# EAGLE design with_usb_small (EAGLE 8.3.1)
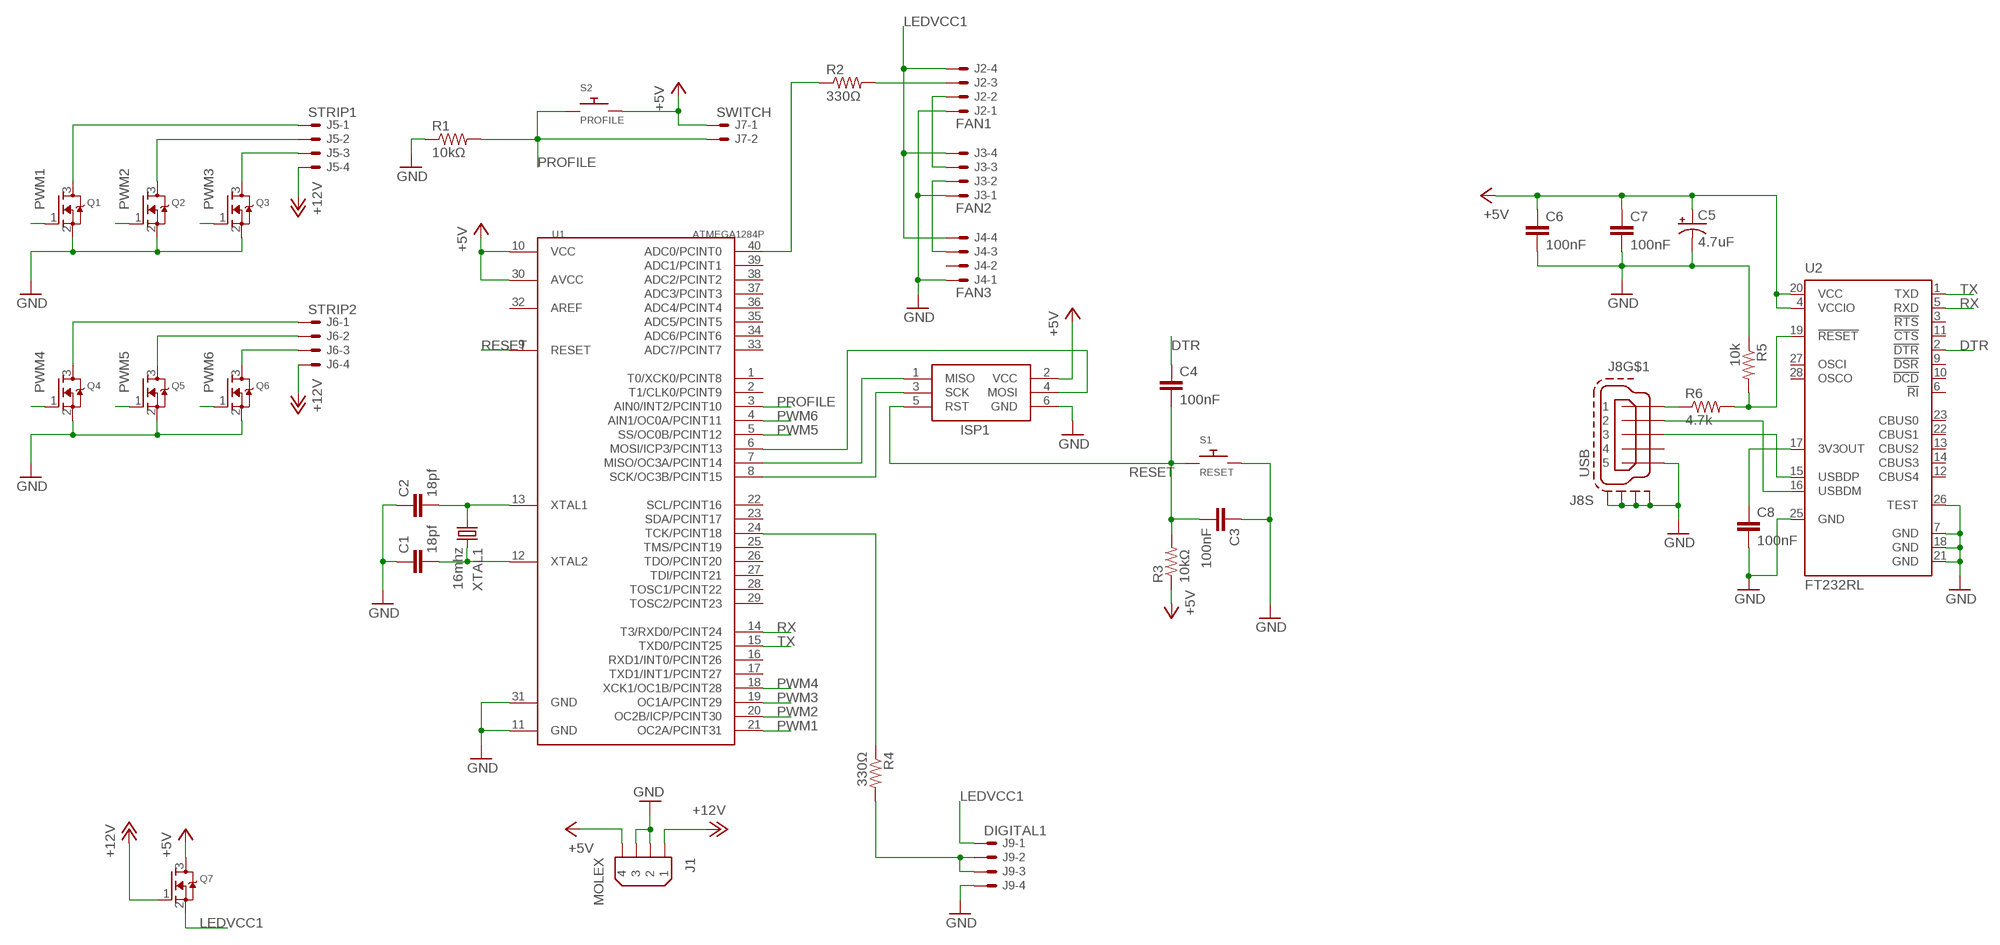
[diagram p0: schematic, sheet 1]

## Parts
C1  18pf  C-EUC0805  [C0805]
C2  18pf  C  [C0805]
C3  100nF  C-EUC0805  [C0805]
C4  100nF  C-EUC0805  [C0805]
C5  4.7uF  CPOL-US153CLV-0505  [153CLV-0505]
C6  100nF  C-EUC0805  [C0805]
C7  100nF  C-EUC0805  [C0805]
C8  100nF  C-EUC0805  [C0805]
ISP1  AVRISP-6  [AVRISP]
J1  MOLEX  9090-4R  [9090-4R]
J2  FAN1  22-23-2041  [22-23-2041]
J3  FAN2  22-23-2041  [22-23-2041]
J4  FAN3  22-23-2041  [22-23-2041]
J5  STRIP1  22-23-2041  [22-23-2041]
J6  STRIP2  22-23-2041  [22-23-2041]
J7  SWITCH  22-23-2021  [22-23-2021]
J8  USB  MINI-USB-SCHIELD-32005-201  [32005-201]
J9  DIGITAL1  22-23-2041  [22-23-2041]
Q1  MOSFET-NREFLOW  [SOT23]
Q2  MOSFET-NREFLOW  [SOT23]
Q3  MOSFET-NREFLOW  [SOT23]
Q4  MOSFET-NREFLOW  [SOT23]
Q5  MOSFET-NREFLOW  [SOT23]
Q6  MOSFET-NREFLOW  [SOT23]
Q7  MOSFET-NREFLOW  [SOT23]
R1  10kΩ  R-US_M0805  [M0805]
R2  330Ω  R-US_M0805  [M0805]
R3  10kΩ  R-US_M0805  [M0805]
R4  330Ω  R-US_M0805  [M0805]
R5  10k  R-US_R0805  [R0805]
R6  4.7k  R-US_R0805  [R0805]
S1  RESET  BUTTON  [B3F-1000]
S2  PROFILE  BUTTON  [B3F-1000]
U1  ATMEGA1284P  MEGA1284P  [DIL40]
U2  FT232RL  [SSOP28]
XTAL1  16mhz  CRYSTALHC49U-V  [HC49U-V]

## Nets
+5V: C5.+ C6.1 C7.1 ISP1.2(VCC) J1.4 J7.1 Q7.3(D) R3.1 S2.3 S2.4 U1.10(VCC) U1.30(AVCC) U2.4(VCCIO) U2.20(VCC)
+12V: J1.1 J5.4 J6.4 Q7.1(G)
D+: J8.3 U2.15(USBDP)
D-: J8.2 U2.16(USBDM)
DIN-D: J9.2 J9.3 R4.2
DTR: C4.1 U2.2(!DTR)
F1-DIN: J2.3 R2.2
F2-DIN: J2.2 J3.3
F3-DIN: J3.2 J4.3
GND: C1.1 C2.1 C3.1 C5.- C6.2 C7.2 C8.2 ISP1.6(GND) J1.2 J1.3 J2.1 J3.1 J4.1 J8.5 J8.M1(S:S1) J8.M2(S:S2) J8.M3(S:S3) J8.M4(S:S4) J9.4 Q1.2(S) Q2.2(S) Q3.2(S) Q4.2(S) Q5.2(S) Q6.2(S) R1.1 R5.1 S1.3 S1.4 U1.11(GND) U1.31(GND) U2.7(GND) U2.18(GND) U2.21(GND) U2.25(GND) U2.26(TEST)
LEDVCC1: J2.4 J3.4 J4.4 J9.1 Q7.2(S)
MISO: ISP1.1(MISO) U1.7(MISO/OC3A/PCINT14)
MOSI: ISP1.4(MOSI) U1.6(MOSI/ICP3/PCINT13)
N$3: C8.1 U2.17(3V3OUT)
N$5: R2.1 U1.40(ADC0/PCINT0)
N$6: R5.2 R6.2 U2.19(!RESET)
N$20: R4.1 U1.24(TCK/PCINT18)
PROFILE: J7.2 R1.2 S2.1 S2.2 U1.3(AIN0/INT2/PCINT10)
PWM1: Q1.1(G) U1.21(OC2A/PCINT31)
PWM2: Q2.1(G) U1.20(OC2B/ICP/PCINT30)
PWM3: Q3.1(G) U1.19(OC1A/PCINT29)
PWM4: Q4.1(G) U1.18(XCK1/OC1B/PCINT28)
PWM5: Q5.1(G) U1.5(SS/OC0B/PCINT12)
PWM6: Q6.1(G) U1.4(AIN1/OC0A/PCINT11)
RESET: C3.2 C4.2 ISP1.5(RST) R3.2 S1.1 S1.2 U1.9(RESET)
RX: U1.14(T3/RXD0/PCINT24) U2.5(RXD)
S1-1: J5.1 Q1.3(D)
S1-2: J5.2 Q2.3(D)
S1-3: J5.3 Q3.3(D)
S2-1: J6.1 Q4.3(D)
S2-2: J6.2 Q5.3(D)
S2-3: J6.3 Q6.3(D)
SCK: ISP1.3(SCK) U1.8(SCK/OC3B/PCINT15)
TX: U1.15(TXD0/PCINT25) U2.1(TXD)
USBVCC: J8.1 R6.1
XTAL1: C2.2 U1.13(XTAL1) XTAL1.1
XTAL2: C1.2 U1.12(XTAL2) XTAL1.2
Unconnected: J4.2 J8.4 U1.1(T0/XCK0/PCINT8) U1.2(T1/CLK0/PCINT9) U1.16(RXD1/INT0/PCINT26) U1.17(TXD1/INT1/PCINT27) U1.22(SCL/PCINT16) U1.23(SDA/PCINT17) U1.25(TMS/PCINT19) U1.26(TDO/PCINT20) U1.27(TDI/PCINT21) U1.28(TOSC1/PCINT22) U1.29(TOSC2/PCINT23) U1.32(AREF) U1.33(ADC7/PCINT7) U1.34(ADC6/PCINT6) U1.35(ADC5/PCINT5) U1.36(ADC4/PCINT4) U1.37(ADC3/PCINT3) U1.38(ADC2/PCINT2) U1.39(ADC1/PCINT1) U2.3(!RTS) U2.6(!RI) U2.9(!DSR) U2.10(!DCD) U2.11(!CTS) U2.12(CBUS4) U2.13(CBUS2) U2.14(CBUS3) U2.22(CBUS1) U2.23(CBUS0) U2.27(OSCI) U2.28(OSCO)

## Library data of the parts
C1 C3 C4 = rcl:C-EU: CAPACITOR, European symbol
C2 = eagle-ltspice:C: CAPACITOR, European symbol; SPICEMODEL: NONE; SPICEPREFIX: C
C5 = resistor:CPOL-US: POLARIZED CAPACITOR, American symbol
C6-C8 = resistor:C-EU: CAPACITOR, European symbol
ISP1 = adafruit:AVRISP: AVR ISP HEADER Standard 6 pin header for AVR programming
J1 = con-thomas-betts:9090-4: Disk Drive Power four position Source: Thomas & Betts Electronic Interconnects Eiropean Edition 1998; OC_FARNELL: unknown; OC_NEWARK: unknown
J2-J6 J9 = con-molex:22-23-2041: .100" (2.54mm) Center Header - 4 Pin; MF: MOLEX; MPN: 22-23-2041; OC_FARNELL: 1462920; OC_NEWARK: 38C0355
J7 = con-molex:22-23-2021: .100" (2.54mm) Center Header - 2 Pin; MF: MOLEX; MPN: 22-23-2021; OC_FARNELL: 1462926; OC_NEWARK: 25C3832
J8 = con-cypressindustries:MINI-USB-SCHIELD-: MINI USB-B Conector Source: www.cypressindustries.com; OC_FARNELL: unknown; OC_NEWARK: unknown
Q1-Q7 = adafruit:MOSFET-N: N-Channel Mosfet 2N7002E - 60V 260mA SOT23 [Digikey: 2N7002ET1GOSTR-ND] - REEL BSH103 - 30V 850mA SOT23 [Digikey: 568-5013-1-ND]
R1-R4 = adafruit:R-US_: RESISTOR, American symbol
R5 R6 = resistor:R-US_: RESISTOR, American symbol
S1 S2 = my_parts:BUTTON
U1 = 1284p:MEGA1284P: Atmel ATmega1284P 8-bit AVR Microcontroller
U2 = ftdichip:FT232R: Source: http://www.ftdichip.com/Documents/DataSheets/DS_FT232R_v104.pdf; MPN: FT232RL; OC_FARNELL: 1146032; OC_NEWARK: 91K9918
XTAL1 = adafruit:CRYSTAL: CRYSTAL; OC_FARNELL: 1666969; OC_NEWARK: unknown

## Net classes
0 default: clearance 0.406 mm

## Board
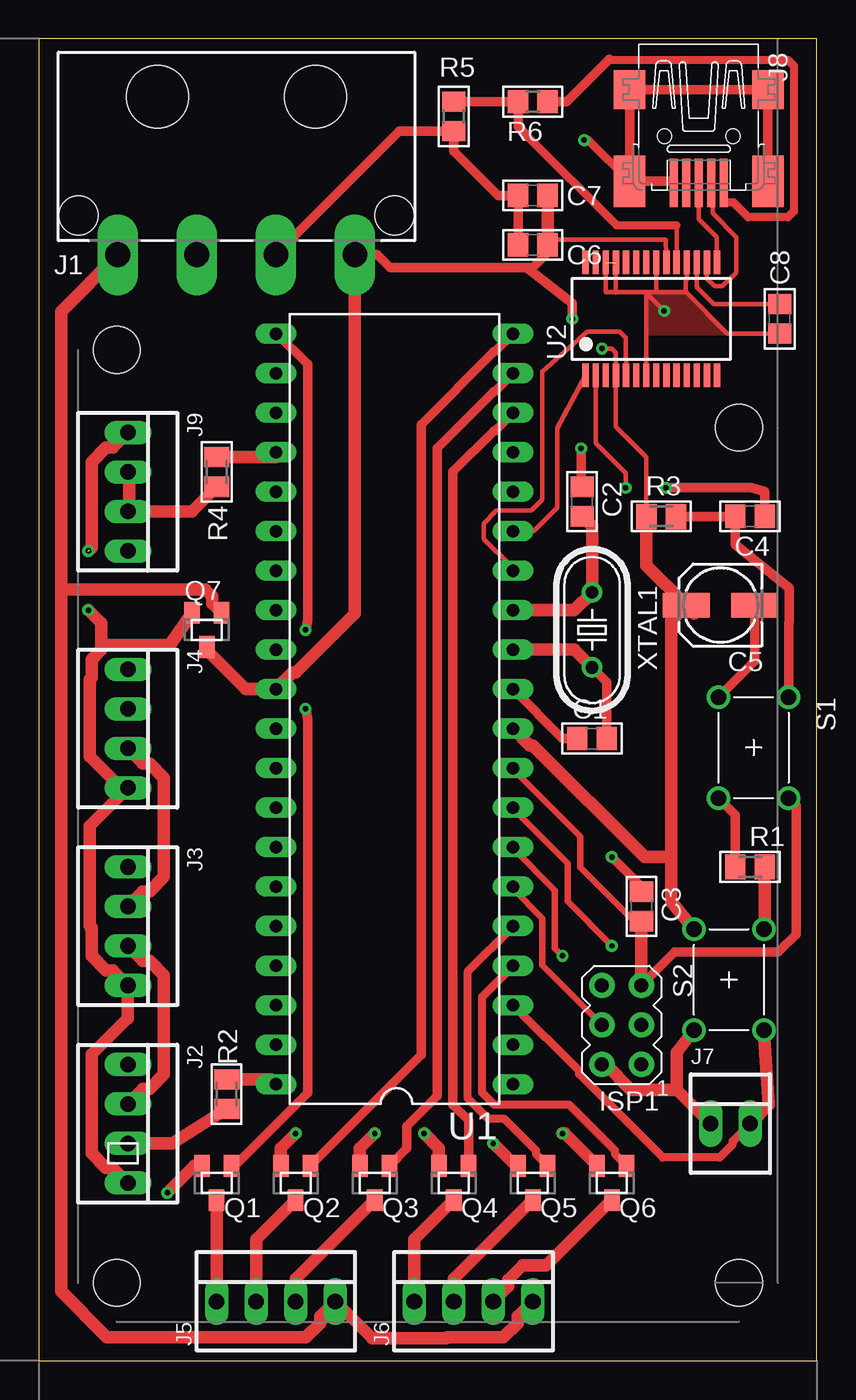
[diagram p1: board, top side]
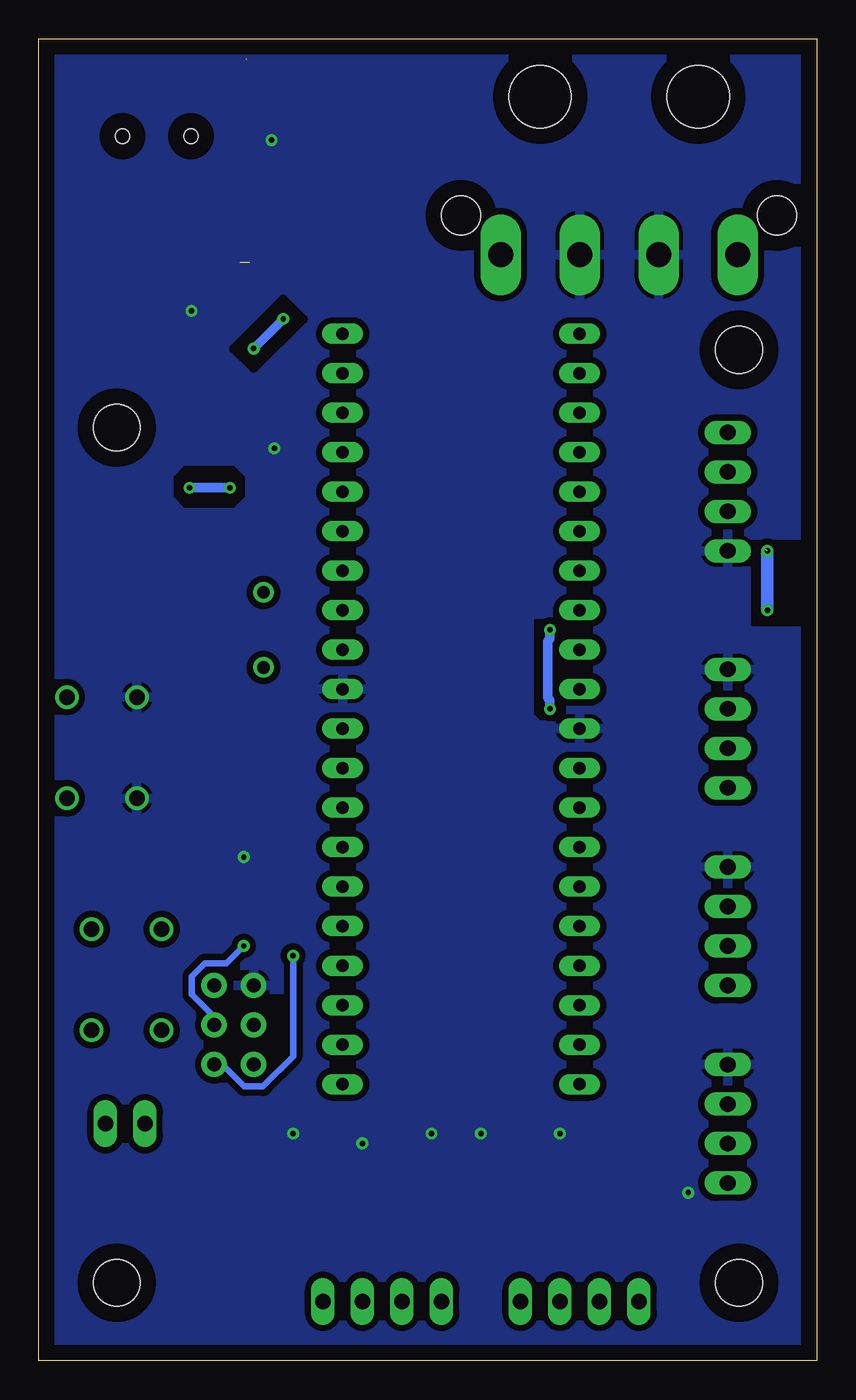
[diagram p2: board, bottom side, seen from below]

Size 50 x 85 mm. Coordinates in mm from the lower left corner, seen from the top.
Outline: 0,0 50,0 50,85 0,85 0,0
Copper layers (1*16): Top 0.035mm / dielectric 1.5mm / Bottom 0.035mm
Design rules "default *": minimum track width 6mil, minimum drill 0.35mm, track to track 6mil, track to pad 6mil, pad to pad 4mil, via to via 6mil, smd to smd 6mil, copper to edge 40mil, drill to drill 6mil, minimum pad ring 10mil, minimum via ring 8mil, stop-mask expansion 4mil, vias tented up to drill 0mil, thermal gap 10mil
Holes 3 mm at 45,5 5,5 5,65 45,60
bRestrict: area 33.7,18.7 to 36.5,23.5; area 1.3,47.3 to 4.1,52.7; area 16.2,41.3 to 18.1,47.6; area 36.8,54.9 to 41.3,57.5; area 33,63.8 to 37.5,68.3

### Footprints (pad centres in the part's own frame; a part is rotated, then mirrored left to right if it is on the bottom)
C0805 = smd 1.3 x 1.5: 1 -0.95,0; 2 0.95,0
153CLV-0505 = smd 3 x 1.6: + 2.2,0; - -2.2,0
AVRISP = drill 0.9 pad 1.626: 1 -1.27,2.54; 2 1.27,2.54; 3 -1.27,0; 4 1.27,0; 5 -1.27,-2.54; 6 1.27,-2.54
9090-4R = drill 1.6 pad 2.6 long: 1 -7.62,-6.35; 2 -2.54,-6.35; 3 2.54,-6.35; 4 7.62,-6.35 | hole 4: -5.08,3.81; 5.08,3.81 | hole 2.5: -10.16,-3.81; 10.16,-3.81
22-23-2041 = drill 1 long: 1 -3.81,0; 2 -1.27,0; 3 1.27,0; 4 3.81,0
22-23-2021 = drill 1 long: 1 -1.27,0; 2 1.27,0
32005-201 = smd 3.1 x 0.5: 1 3,1.6; 2 3,0.8; 3 3,0; 4 3,-0.8; 5 3,-1.6 | smd 2.5 x 2: M1 -3,-4.45; M2 -3,4.45 | smd 3.3 x 2: M3 2.9,4.45; M4 2.9,-4.45 | hole 0.9: 0,2.2; 0,-2.2
SOT23 = smd 1 x 1.4: 1 -0.95,-1.1; 2 0.95,-1.1; 3 0,1.1
M0805 = smd 1.3 x 1.6: 1 -0.95,0; 2 0.95,0
R0805 = smd 1.3 x 1.5: 1 -0.95,0; 2 0.95,0
B3F-1000 = drill 1: 1 -4.25,3.75; 2 2.25,3.75; 3 -4.25,-0.75; 4 2.25,-0.75
DIL40 = drill 0.813 long: 1 -24.13,-7.62; 2 -21.59,-7.62; 3 -19.05,-7.62; 4 -16.51,-7.62; 5 -13.97,-7.62; 6 -11.43,-7.62; 7 -8.89,-7.62; 8 -6.35,-7.62; 9 -3.81,-7.62; 10 -1.27,-7.62; 11 1.27,-7.62; 12 3.81,-7.62; 13 6.35,-7.62; 14 8.89,-7.62; 15 11.43,-7.62; 16 13.97,-7.62; 17 16.51,-7.62; 18 19.05,-7.62; 19 21.59,-7.62; 20 24.13,-7.62; 21 24.13,7.62; 22 21.59,7.62; 23 19.05,7.62; 24 16.51,7.62; 25 13.97,7.62; 26 11.43,7.62; 27 8.89,7.62; 28 6.35,7.62; 29 3.81,7.62; 30 1.27,7.62; 31 -1.27,7.62; 32 -3.81,7.62; 33 -6.35,7.62; 34 -8.89,7.62; 35 -11.43,7.62; 36 -13.97,7.62; 37 -16.51,7.62; 38 -19.05,7.62; 39 -21.59,7.62; 40 -24.13,7.62
SSOP28 = smd 0.4 x 1.5: 1 -4.225,-3.625; 2 -3.575,-3.625; 3 -2.925,-3.625; 4 -2.275,-3.625; 5 -1.625,-3.625; 6 -0.975,-3.625; 7 -0.325,-3.625; 8 0.325,-3.625; 9 0.975,-3.625; 10 1.625,-3.625; 11 2.275,-3.625; 12 2.925,-3.625; 13 3.575,-3.625; 14 4.225,-3.625; 15 4.225,3.625; 16 3.575,3.625; 17 2.925,3.625; 18 2.275,3.625; 19 1.625,3.625; 20 0.975,3.625; 21 0.325,3.625; 22 -0.325,3.625; 23 -0.975,3.625; 24 -1.625,3.625; 25 -2.275,3.625; 26 -2.925,3.625; 27 -3.575,3.625; 28 -4.225,3.625
HC49U-V = drill 0.813: 1 -2.413,0; 2 2.413,0

### Placement (x,y rotation side)
C1  35.56,40.01 0 top
C2  34.92,55.24 270 top
C3  38.73,29.21 270 top
C4  45.72,54.29 180 top
C5  43.81,48.58 180 top
C6  31.75,71.75 180 top
C7  31.75,74.93 180 top
C8  47.62,66.99 270 top
ISP1  37.47,21.59 180 top
J1  12.7,77.47 0 top
J2  5.71,15.24 270 top
J3  5.71,27.94 270 top
J4  5.71,40.64 270 top
J5  15.24,3.81 0 top
J6  27.94,3.81 0 top
J7  44.45,15.24 0 top
J8  42.42,78.74 270 top
J9  5.71,55.88 270 top
Q1  11.43,11.43 180 top
Q2  16.51,11.43 180 top
Q3  21.59,11.43 180 top
Q4  26.67,11.43 180 top
Q5  31.75,11.43 180 top
Q6  36.83,11.43 180 top
Q7  10.79,46.99 180 top
R1  45.72,31.75 0 top
R2  12.06,17.14 270 top
R3  40.01,54.29 0 top
R4  11.43,57.15 270 top
R5  26.67,80.01 90 top
R6  31.75,80.96 180 top
S1  44.45,38.42 270 top
S2  42.86,23.5 270 top
U1  22.86,41.91 90 top
U2  39.37,66.99 0 top
XTAL1  35.56,46.99 270 top

### Tracks (layer width: path | path; a pad name or v marks a point on that pad's centre or on a via)
+5V  (via drill 0.35)
  Top 0.305: U2.20 40.34,71.07 40.3,72.07 33.34,72.07 C6.1 | R3.1 39.05,58.09 37.09,60.05 U2.4 37.09,64.82 36.83,65.09 v36.2,65.09
  Top 0.61: v34.29,66.99 34.29,68 31.36,70.29 | J1.4 21.76,71.12 22.59,70.29 31.36,70.29 | 31.36,70.29 31.75,70.29 32.7,71.25 C6.1
  Top 0.813: Q7.3 10.79,45.68 13.3,43.18 U1.30 16.31,44.25 16.51,44.25 20.32,48.06 J1.4 | C5.+ 39.05,51.14 R3.1 | C7.1 C6.1 | 41,17.42 J7.1 | ISP1.2 36.44,19.05 38.06,17.42 41,17.42 | S2.4 41,19.81 41,17.42 | C5.+ 42.13,48.06 | 31.11,40.64 U1.10 31.55,39.57 31.75,39.57 38.94,32.38 40.64,32.38 | 40.64,32.38 40.64,29.54 S2.3 | C5.+ 40.64,47.6 40.64,32.38
  Bottom 0.61: v36.2,65.09 v34.29,66.99
+12V
  Top 0.813: J6.4 30.78,2.84 30.78,2.41 29.86,1.49 26.25,1.49 26.19,1.42 21.44,1.42 J5.4 18.08,2.84 18.08,2.41 17.16,1.49 4.38,1.49 1.42,4.45 1.42,49.62 | Q7.1 11.16,48.68 11.16,49.13 10.68,49.6 1.44,49.6 1.42,49.62 | 1.42,49.62 1.42,67.46 J1.1
D+
  Top 0.305: U2.15 43.56,70.65 43.56,72.26 42.42,73.41 J8.3
D-
  Top 0.305: U2.16 42.93,70.6 42.93,69.6 43.43,69.09 43.94,69.09 44.83,69.98 44.83,72.26 43.31,73.79 | 43.31,73.79 43.31,73.86 | J8.2 43.31,75.65 43.31,73.79
DIN-D
  Top 0.813: R4.2 9.84,54.61 5.81,54.61 | 5.81,54.61 J9.3 | J9.2 5.81,57.05 5.81,54.61
DTR  (via drill 0.35)
  Top 0.305: U2.2 35.8,59.01 37.72,57.09 v37.72,56.13
  Top 0.61: C4.1 46.67,55.88 45.78,56.13 v40.32,56.13
  Bottom 0.61: v37.72,56.13 v40.32,56.13
F1-DIN
  Top 0.813: R2.2 8.57,13.97 J2.3
F2-DIN
  Top 0.813: J2.2 6.69,17.48 7.12,17.48 8.04,18.4 8.04,24.78 7.12,25.7 6.69,25.7 J3.3
F3-DIN
  Top 0.813: J3.2 6.69,30.18 7.12,30.18 8.04,31.1 8.04,37.48 7.12,38.4 6.69,38.4 J4.3
GND  (via drill 0.35)  (1 unrouted)
  Top 0.305: 41.58,68.73 41.58,69.46 41.65,69.53 U2.18 | C8.2 44.27,66.04 41.58,68.73 | U2.26 36.45,68.7 39.04,68.7 | U2.25 37.09,68.7 | 39.78,68.7 39.04,68.7 | 39.78,68.7 41.55,68.7 41.58,68.73 | U2.7 39.05,68.45 | 39.05,68.45 39.05,68.69 39.04,68.7 | 39.05,68.45 39.24,68.45 v40.2,67.5 | U2.21 39.7,68.79 39.78,68.7
  Top 0.508: J8.5 40.81,75.74 | v35.05,78.49 35.32,78.49 J8.M4
  Top 0.61: S1.4 44.77,35.1 R1.1 | C1.1 33.66,40.01 U1.11 | C6.2 C7.2 29.53,74.93 26.67,77.79 R5.1 23.18,79.06 J1.3 | C3.1 38.73,30.48 v36.83,32.38 | S1.3 46.02,44.98 C5.- | J8.M3 J8.M2 J8.M1 J8.M4 40.71,75.84 40.81,75.74 | C2.1 34.86,56.2 v34.86,58.67
  Top 0.813: Q1.2 9.99,12.53 v8.26,10.79 | Q2.2 15.56,13.65 v16.51,14.61 | Q3.2 20.64,13.65 v21.59,14.61 | Q4.2 25.72,13.65 v24.77,14.61 | Q5.2 30.65,12.53 v29.21,13.97 | v33.66,14.61 33.8,14.61 Q6.2
  pour Bottom: 0,85 50,85 50,0 0,0
  pour Top: 39.24,66.17 39.24,68.45 41.53,68.45 41.91,68.07 44.01,66.17
LEDVCC1  (via drill 0.35)  (1 unrouted)
  Top 0.813: Q7.2 8.41,46.02 4.31,46.02 4.01,45.72 | 4.01,45.72 3.39,45.1 3.39,43.93 3.28,43.81 3.28,38.84 5.29,36.83 J4.4 3.28,34.39 3.28,27.94 3.39,27.82 3.39,26.02 4.31,25.1 4.74,25.1 J3.4 5.71,22.02 3.39,19.7 3.39,13.32 4.31,12.4 4.74,12.4 J2.4 | v3.17,48.26 4.01,47.42 4.01,45.72 | 3.28,52.17 3.39,52.29 3.39,57.8 4.31,58.72 4.74,58.72 J9.1
  Bottom 0.813: v3.17,52.07 v3.17,48.26
MISO  (via drill 0.35)
  Top 0.406: v33.66,26.04 33.17,26.52 33.17,30.24 30.48,32.94 U1.7
  Bottom 0.406: v33.66,26.04 33.66,19.58 35.61,17.63 36.78,17.63 38.21,19.05 ISP1.1
MOSI
  Top 0.305: 30.48,30.32 U1.6
  Top 0.406: ISP1.4 32.36,25.43 32.36,28.45 30.48,30.32
N$3
  Top 0.305: U2.17 42.29,69.98 42.29,69.03 43.37,67.94 C8.1
N$5
  Top 0.813: U1.40 14.93,18.09 R2.1
N$6
  Top 0.305: 40.99,73.02 U2.19
  Top 0.508: 31.11,79.07 31.28,78.88 | 31.28,78.88 31.35,78.88 | 31.28,78.88 37.14,73.02 40.99,73.02
  Top 0.61: R5.2 R6.2 30.8,79.35 31.28,78.88
N$20
  Top 0.813: R4.1 15.24,58.1 U1.24
PROFILE
  Top 0.508: U1.3 34.72,18.62 34.72,18.44 40.09,13.07 43.77,13.07 44.59,13.9 44.59,14.11 J7.2
  Top 0.813: S2.1 46.67,28 R1.2 | J7.2 46.93,16.45 S2.2
PWM1  (via drill 0.35)
  Top 0.61: Q1.1 12.59,12.53 17.27,17.21 17.27,41.27 v17.14,41.91 | U1.21 15.3,66.04 17.27,64.07 17.27,47.62 v17.14,46.99
  Bottom 0.61: v17.14,41.91 17.14,42.48 17.27,42.61 17.27,46.29 17.14,46.41 v17.14,46.99
PWM2
  Top 0.61: U1.20 29.31,64.87 29.25,64.87 24.59,60.21 24.59,19.66 Q2.1
PWM3
  Top 0.61: Q3.1 23.65,13.64 23.65,15.07 25.6,17.02 25.6,58.68 29.25,62.33 29.31,62.33 U1.19
PWM4
  Top 0.61: U1.18 29.31,59.79 29.25,59.79 26.62,57.16 26.62,16.45 27.62,15.45 Q4.1
PWM5
  Top 0.508: Q5.1 31.96,13.27 31.96,13.5 29.92,15.54 28.89,15.54 27.58,16.85 27.58,25.03 30.48,27.93 U1.5
PWM6
  Top 0.508: Q6.1 37.04,13.27 37.04,13.5 34.09,16.46 29.27,16.46 28.5,17.23 28.5,23.41 30.48,25.39 U1.4
RESET
  Top 0.406: 38.73,27.79 34.8,31.72 34.8,33.7 30.48,38.02 U1.9
  Top 0.61: ISP1.5 40.88,26.28 47.54,26.28 48.68,27.42 48.68,35.69 S1.2 | R3.2 C4.2 44.77,52.49 48.23,49.67 48.23,47.48 48.2,47.46 S1.1
  Top 0.813: ISP1.5 38.73,27.79 C3.2
RX
  Top 0.305: U1.14 30.48,50.95 28.6,52.84 28.6,53.84 29.42,54.66 31.64,54.66 32.36,55.38 32.36,63.6 35.24,66.17 37.34,66.17 37.72,65.79 37.72,64.48 37.74,64.46 U2.5
S1-1
  Top 0.813: J5.1 Q1.3
S1-2
  Top 0.813: J5.2 13.97,7.79 Q2.3
S1-3
  Top 0.813: J5.3 16.51,5.25 Q3.3
S2-1
  Top 0.813: J6.1 24.13,7.79 Q4.3
S2-2
  Top 0.813: J6.2 26.67,5.25 Q5.3
S2-3
  Top 0.813: Q6.3 32.63,6.13 31.1,6.13 30.18,5.21 30.18,4.78 J6.3
SCK  (via drill 0.35)
  Top 0.406: v36.83,26.67 33.98,29.52 33.98,31.97 30.48,35.48 U1.8
  Bottom 0.406: v36.83,26.67 37.95,25.55 39.32,25.55 40.16,24.72 40.16,23.54 38.73,22.12 ISP1.3
TX
  Top 0.305: U1.15 31.81,53.34 33.34,54.86 33.34,59.97 U2.1
USBVCC  (1 unrouted)
  Top 0.508: 44.16,74.49 44.64,74.49 45.59,73.53 48.14,73.53 48.53,73.92 48.53,83.26 48.14,83.65 36.69,83.65 | 44.16,74.49 44.13,74.49 44.13,74.55 | J8.1 44.02,74.63 44.16,74.49
  Top 0.61: R6.1 33.94,80.96 36.65,83.68
XTAL1
  Top 0.813: C2.2 35.56,53.66 XTAL1.1 34.42,48.26 U1.13
XTAL2
  Top 0.61: C1.2 36.51,43.63 XTAL1.2
  Top 0.813: U1.12 34.42,45.72 XTAL1.2